# EasyEDA schematic can-municator-board.json
TITLE: Sheet_1; REV: 1.0; Date: 2022-07-23; Sheet: 1/1; Company: Your Company
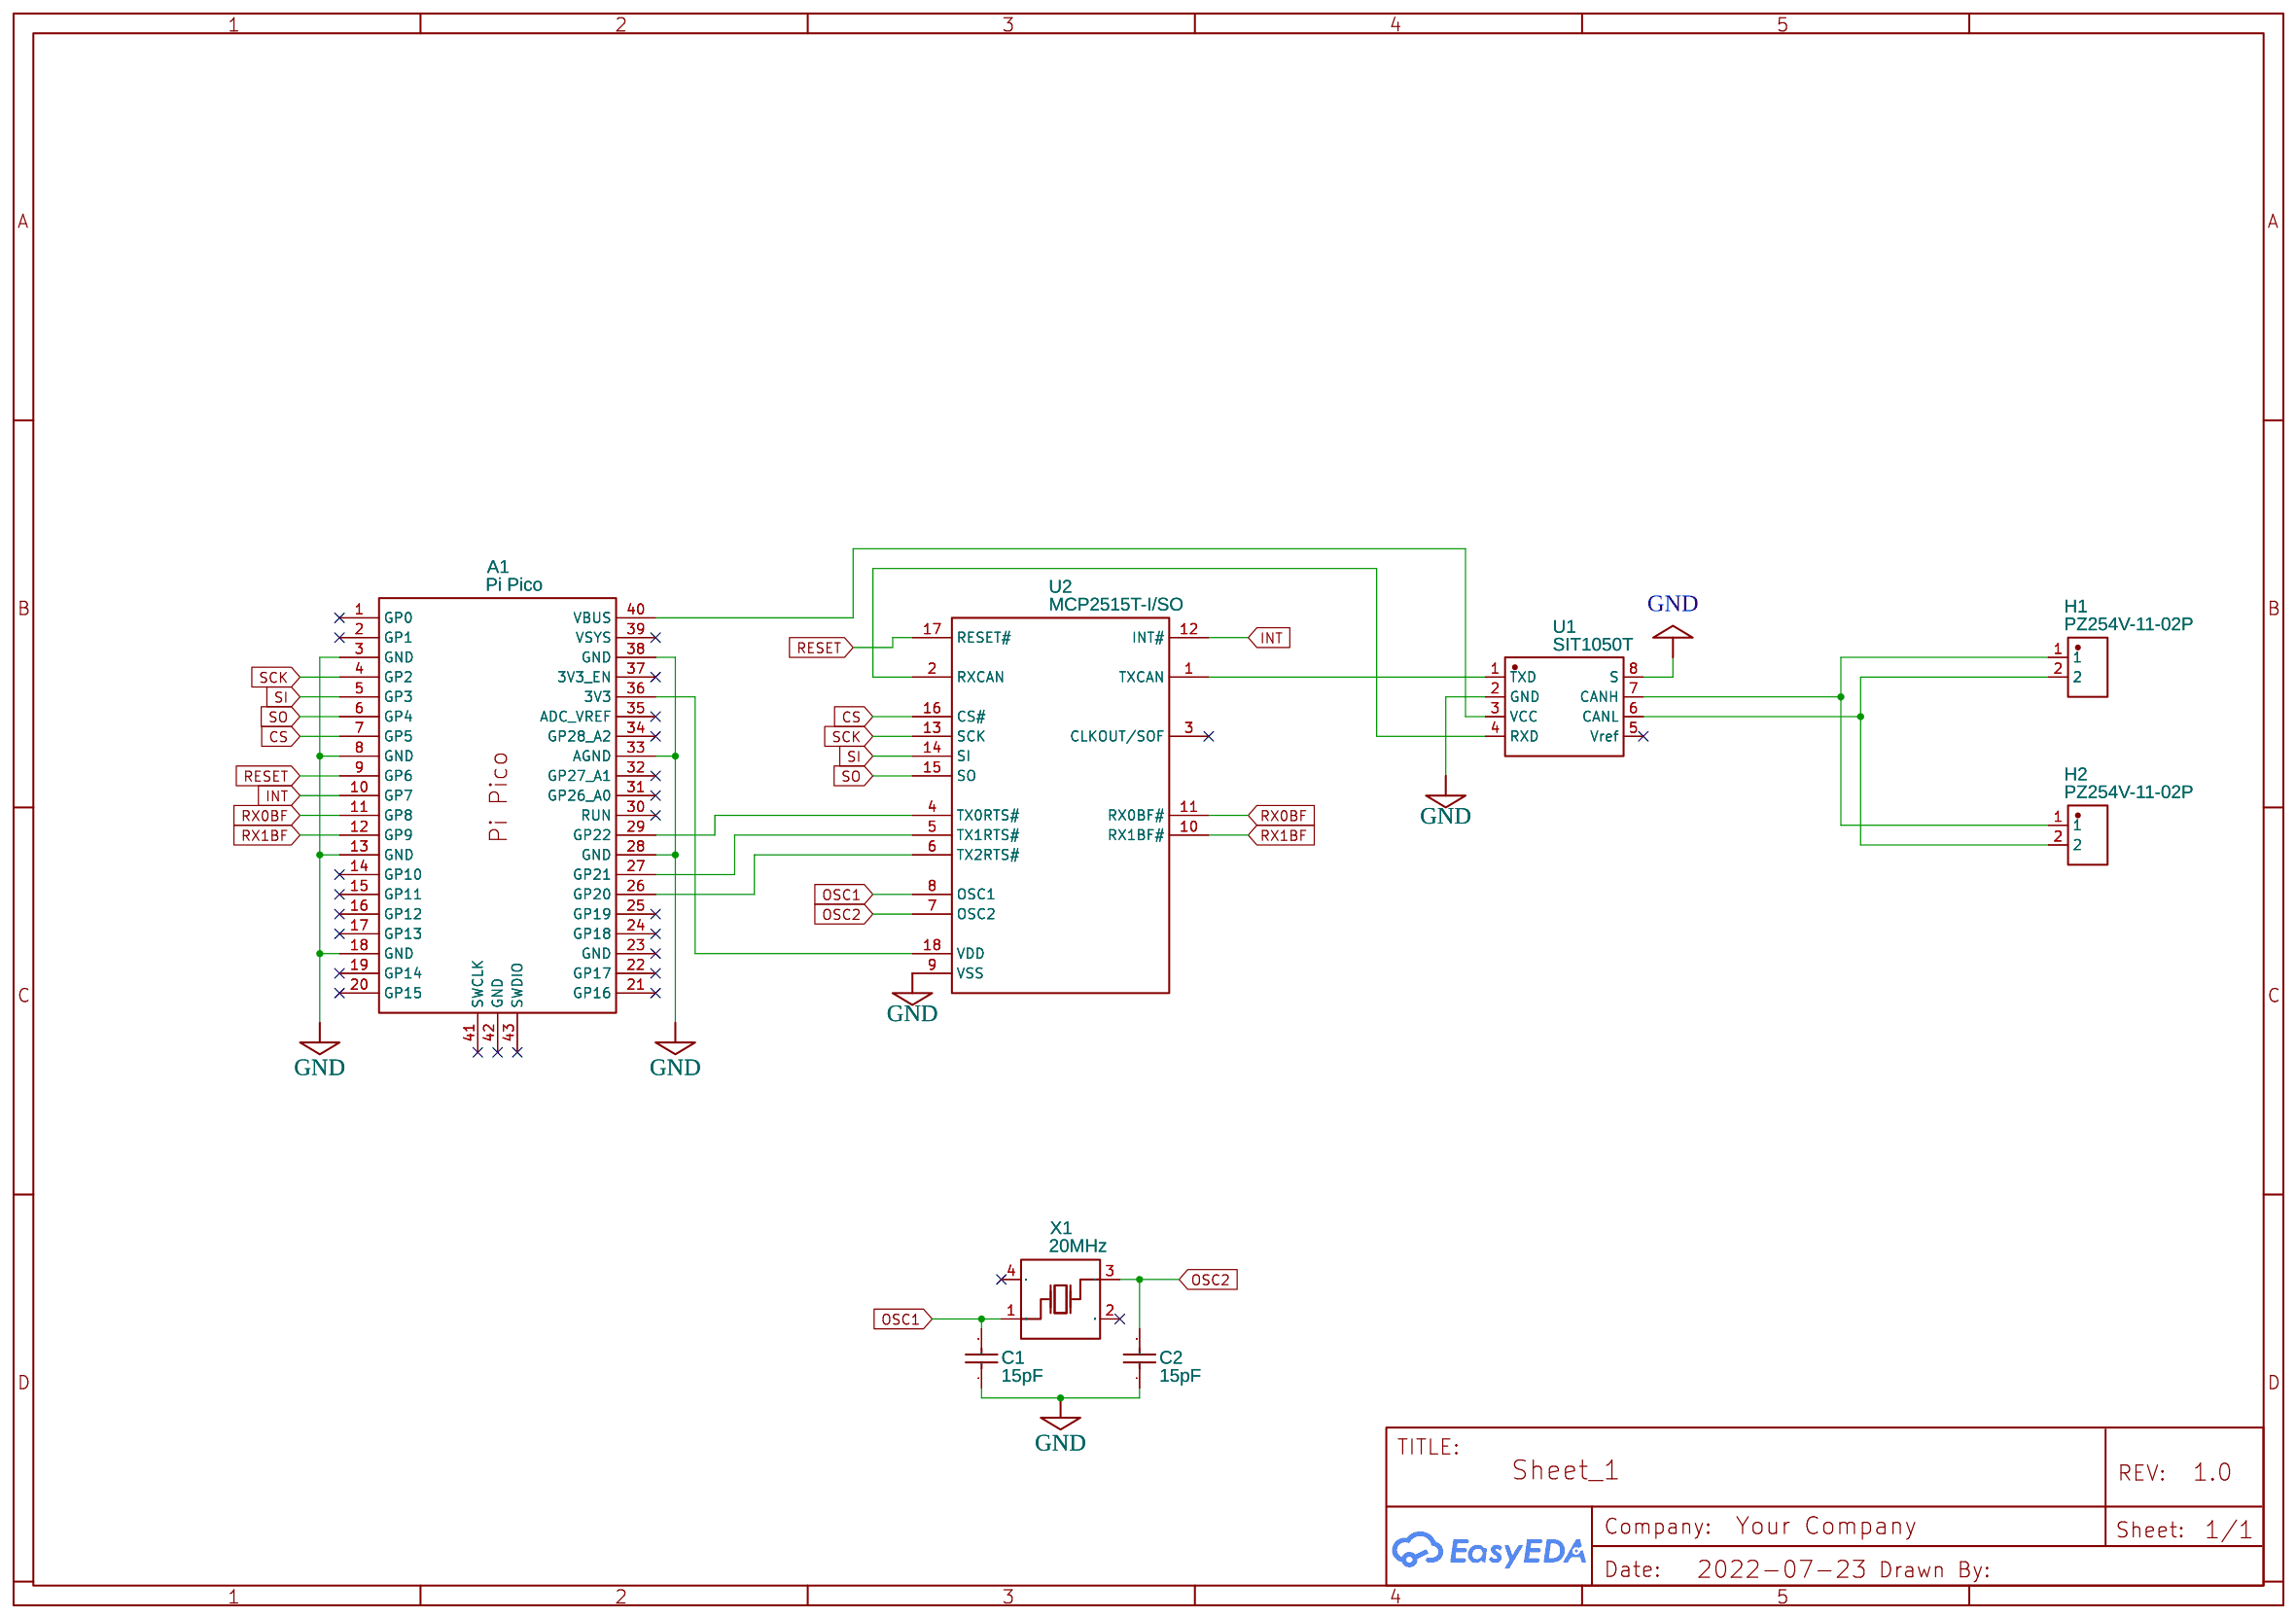
[diagram p0: schematic sheet]

## Parts
A1  Pi Pico  [PIPICO_FOOTPRINT]
C1  15pF  [C0402]
C2  15pF  [C0402]
H1  PZ254V-11-02P  [HDR-TH_2P-P2.54-V-M]
H2  PZ254V-11-02P  [HDR-TH_2P-P2.54-V-M]
U1  SIT1050T  [SO-8_L4.9-W3.9-P1.27-LS5.9-BL]
U2  MCP2515T-I/SO  [SOIC-18_L11.6-W7.5-P1.27-LS10.3-BL]
X1  20MHz  [OSC-SMD_4P-L3.2-W2.5-BL]

## Library data of the parts
A1 = Pi Pico: Manufacturer: Raspberry Pi; Manufacturer Part: SC0915; Supplier: Digi-Key; Supplier Part: 2648-SC0915TR-ND; link: https://datasheets.raspberrypi.org/pico/pico-datasheet.pdf; Contributor: Joe Thomas
C1 C2 = 0402CG150J500NT: Supplier: LCSC; Manufacturer: FH; Supplier Part: C1548; JLCPCB Part Class: Basic Part
H1 H2 = PZ254V-11-02P: Supplier: LCSC; Supplier Part: C492401; Manufacturer: XFCN; Contributor: LCSC; JLCPCB Part Class: Extended Part
U1 = SIT1050T: Supplier: LCSC; Supplier Part: C313021; Manufacturer: SIT; Contributor: LCSC; JLCPCB Part Class: Extended Part
U2 = MCP2515T-I/SO: Supplier: LCSC; Manufacturer: MICROCHIP; Contributor: LCSC; Supplier Part: C153782; JLCPCB Part Class: Extended Part
X1 = X322520MSB4SI: Supplier: LCSC; Manufacturer: YXC; Supplier Part: C9004; JLCPCB Part Class: Extended Part

## Nets
GND: A1.3(GND) A1.8(GND) A1.13(GND) A1.18(GND) A1.28(GND) A1.33(AGND) A1.38(GND) C1.1 C2.1 U1.2(GND) U1.8(S) U2.9(VSS)
CS: A1.7(GP5) U2.16(CS#)
INT: A1.10(GP7) U2.12(INT#)
OSC1: C1.2 U2.8(OSC1) X1.1(OSC1)
OSC2: C2.2 U2.7(OSC2) X1.3(OSC2)
RESET: A1.9(GP6) U2.17(RESET#)
RX0BF: A1.11(GP8) U2.11(RX0BF#)
RX1BF: A1.12(GP9) U2.10(RX1BF#)
SCK: A1.4(GP2) U2.13(SCK)
SI: A1.5(GP3) U2.14(SI)
SO: A1.6(GP4) U2.15(SO)
Net-(A1-26): A1.26(GP20) U2.6(TX2RTS#)
Net-(A1-27): A1.27(GP21) U2.5(TX1RTS#)
Net-(A1-29): A1.29(GP22) U2.4(TX0RTS#)
Net-(A1-36): A1.36(3V3) U2.18(VDD)
Net-(A1-40): A1.40(VBUS) U1.3(VCC)
Net-(H1-1): H1.1 H2.1 U1.7(CANH)
Net-(H1-2): H1.2 H2.2 U1.6(CANL)
Net-(U1-1): U1.1(TXD) U2.1(TXCAN)
Net-(U1-4): U1.4(RXD) U2.2(RXCAN)

Not connected (* = marked no-connect by the designer): A1 1(GP0)* 2(GP1)* 14(GP10)* 15(GP11)* 16(GP12)* 17(GP13)* 19(GP14)* 20(GP15)* 21(GP16)* 22(GP17)* 23(GND)* 24(GP18)* 25(GP19)* 30(RUN)* 31(GP26_A0)* 32(GP27_A1)* 34(GP28_A2)* 35(ADC_VREF)* 37(3V3_EN)* 39(VSYS)* 41(SWCLK)* 42(GND)* 43(SWDIO)*; U1 5(Vref)*; U2 3(CLKOUT/SOF)*; X1 2(GND)* 4(GND)*
